# EAGLE design xbee-radio (EAGLE 6.3)
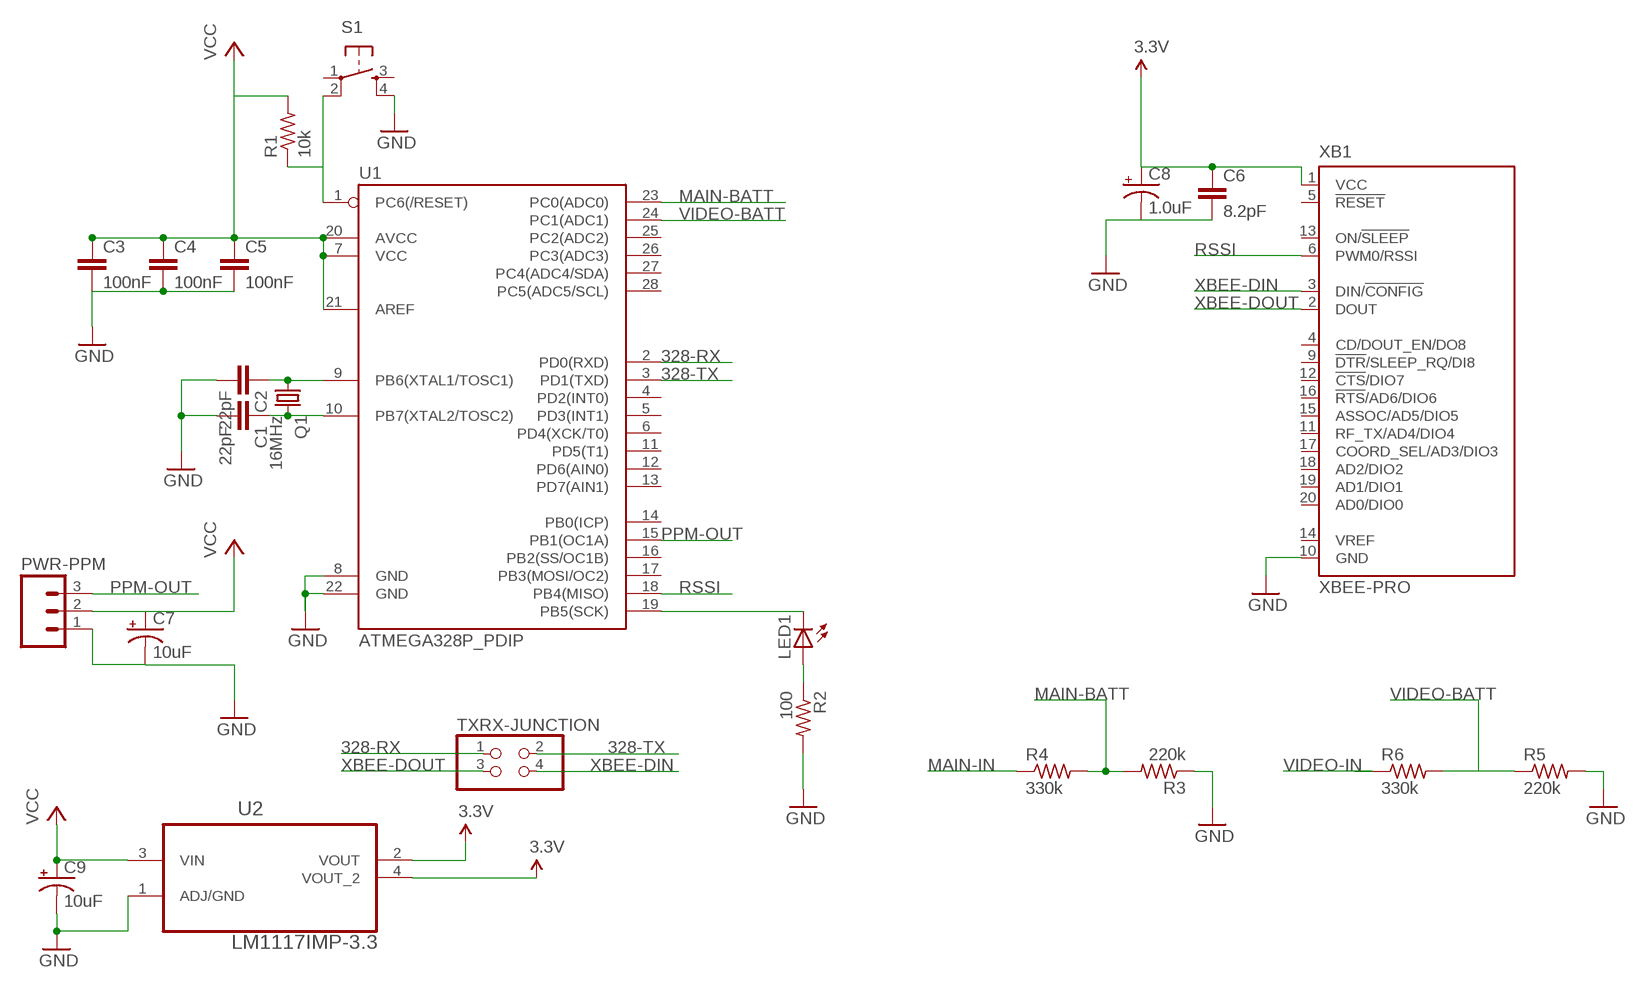
[diagram p0: schematic, sheet 1]

## Parts
C1  22pF  C2.5/2  [C2.5-2]
C2  22pF  C2.5/2  [C2.5-2]
C3  100nF  C2.5/2  [C2.5-2]
C4  100nF  C2.5/2  [C2.5-2]
C5  100nF  C2.5/2  [C2.5-2]
C6  8.2pF  C2.5/2  [C2.5-2]
C7  10uF  CPOL-USE2-5  [E2-5]
C8  1.0uF  CPOL-USE2-5  [E2-5]
C9  10uF  CPOL-USE2-5  [E2-5]
LED1  LED3MM  [LED3MM]
PWR-PPM  M03PTH  [1X03]
Q1  16MHz  CRYSTALTC26V  [TC26V]
R1  10k  R-US_0204/5  [0204/5]
R2  100  R-US_0204/5  [0204/5]
R3  220k  R-US_0204/5  [0204/5]
R4  330k  R-US_0204/5  [0204/5]
R5  220k  R-US_0204/5  [0204/5]
R6  330k  R-US_0204/5  [0204/5]
S1  TAC_SWITCHPTH  [TACTILE-PTH]
TXRX-JUNCTION  PINHD-2X2  [2X02]
U1  ATMEGA328P_PDIP  [DIL28-3]
U2  LM1117IMP-3.3  [SOT230P696X180-4N]
XB1  XBEE-PRO  [XBEE-PRO]

## Nets
3.3V: C6.1 C8.+ U2.2(VOUT) U2.4(VOUT_2) XB1.1(VCC)
328-RX: TXRX-JUNCTION.1 U1.2(PD0(RXD))
328-TX: TXRX-JUNCTION.2 U1.3(PD1(TXD))
GND: C1.2 C2.2 C3.2 C4.2 C5.2 C6.2 C7.- C8.- C9.- PWR-PPM.1 R2.2 R3.1 R5.2 S1.4 U1.8(GND) U1.22(GND) U2.1(ADJ/GND) XB1.10(GND)
MAIN-BATT: R3.2 R4.2 U1.23(PC0(ADC0))
MAIN-IN: R4.1
N$1: R1.1 S1.2 U1.1(PC6(/RESET))
N$2: C1.1 Q1.2 U1.10(PB7(XTAL2/TOSC2))
N$3: C2.1 Q1.1 U1.9(PB6(XTAL1/TOSC1))
N$4: LED1.K(C) U1.19(PB5(SCK))
N$5: LED1.A R2.1
PPM-OUT: PWR-PPM.3 U1.15(PB1(OC1A))
RSSI: U1.18(PB4(MISO)) XB1.6(PWM0/RSSI)
VCC: C3.1 C4.1 C5.1 C7.+ C9.+ PWR-PPM.2 R1.2 U1.7(VCC) U1.20(AVCC) U1.21(AREF) U2.3(VIN)
VIDEO-BATT: R5.1 R6.2 U1.24(PC1(ADC1))
VIDEO-IN: R6.1
XBEE-DIN: TXRX-JUNCTION.4 XB1.3(DIN/!CONFIG)
XBEE-DOUT: TXRX-JUNCTION.3 XB1.2(DOUT)
Unconnected: S1.1 S1.3 U1.4(PD2(INT0)) U1.5(PD3(INT1)) U1.6(PD4(XCK/T0)) U1.11(PD5(T1)) U1.12(PD6(AIN0)) U1.13(PD7(AIN1)) U1.14(PB0(ICP)) U1.16(PB2(SS/OC1B)) U1.17(PB3(MOSI/OC2)) U1.25(PC2(ADC2)) U1.26(PC3(ADC3)) U1.27(PC4(ADC4/SDA)) U1.28(PC5(ADC5/SCL)) XB1.4(CD/DOUT_EN/DO8) XB1.5(!RESET) XB1.9(!DTR!/SLEEP_RQ/DI8) XB1.11(RF_TX/AD4/DIO4) XB1.12(!CTS!/DIO7) XB1.13(ON/!SLEEP) XB1.14(VREF) XB1.15(ASSOC/AD5/DIO5) XB1.16(!RTS!/AD6/DIO6) XB1.17(COORD_SEL/AD3/DIO3) XB1.18(AD2/DIO2) XB1.19(AD1/DIO1) XB1.20(AD0/DIO0)

## Library data of the parts
C1-C6 = capacitor-wima:C: CAPACITOR naming: grid - package width
C7-C9 = resistor:CPOL-US: POLARIZED CAPACITOR, American symbol
LED1 = led:LED: LED OSRAM: - CHIPLED LG R971, LG N971, LY N971, LG Q971, LY Q971, LO R971, LY R971 LH N974, LH R974 LS Q976, LO Q976, LY Q976 LO Q996 - Hyper CHIPLED LW Q18S LB Q993, LB Q99A, LB R99A - SideLED LS A670, LO A670, LY A670, LG A670, LP A670 LB A673, LV A673, LT A673, LW A673 LH A674 LY A675 LS A676, LA A676, LO A676, LY A676, LW A676 LS A679, LY A679, LG A679 - Hyper Micro SIDELED® LS Y876, LA Y876, LO Y876, LY Y876 LT Y87S - SmartLED LW L88C, LW L88S LB L89C, LB L89S, LG L890 LS L89K, LO L89K, LY L89K LS L896, LA L896, LO L896, LY L896 - TOPLED LS T670, LO T670, LY T670, LG T670, LP T670 LSG T670, LSP T670, LSY T670, LOP T670, LYG T670 LG T671, LOG T671, LSG T671 LB T673, LV T673, LT T673, LW T673 LH T674 LS T676, LA T676, LO T676, LY T676, LB T676, LH T676, LSB T676, LW T676 LB T67C, LV T67C, LT T67C, LS T67K, LO T67K, LY T67K, LW E67C LS E67B, LA E67B, LO E67B, LY E67B, LB E67C, LV E67C, LT E67C LW T67C LS T679, LY T679, LG T679 LS T770, LO T770, LY T770, LG T770, LP T770 LB T773, LV T773, LT T773, LW T773 LH T774 LS E675, LA E675, LY E675, LS T675 LS T776, LA T776, LO T776, LY T776, LB T776 LHGB T686 LT T68C, LB T68C - Hyper Mini TOPLED® LB M676 - Mini TOPLED Santana® LG M470 LS M47K, LO M47K, LY M47K Source: http://www.osram.convergy.de LUXEON: - LUMILED® LXK2-PW12-R00, LXK2-PW12-S00, LXK2-PW14-U00, LXK2-PW14-V00 LXK2-PM12-R00, LXK2-PM12-S00, LXK2-PM14-U00 LXK2-PE12-Q00, LXK2-PE12-R00, LXK2-PE12-S00, LXK2-PE14-T00, LXK2-PE14-U00 LXK2-PB12-K00, LXK2-PB12-L00, LXK2-PB12-M00, LXK2-PB14-N00, LXK2-PB14-P00, LXK2-PB14-Q00 LXK2-PR12-L00, LXK2-PR12-M00, LXK2-PR14-Q00, LXK2-PR14-R00 LXK2-PD12-Q00, LXK2-PD12-R00, LXK2-PD12-S00 LXK2-PH12-R00, LXK2-PH12-S00 LXK2-PL12-P00, LXK2-PL12-Q00, LXK2-PL12-R00 Source: www.luxeon.com KINGBRIGHT: KA-3528ASYC Source: www.kingbright.com
PWR-PPM = SparkFun-Connectors:M03: Header 3 Standard 3-pin 0.1" header. Use with straight break away headers (SKU : PRT-00116), right angle break away headers (PRT-00553), swiss pins (PRT-00743), machine pins (PRT-00117), and female headers (PRT-00115). Molex polarized connector foot print use with SKU : PRT-08232 with associated crimp pins and housings.
Q1 = crystal:CRYSTAL: CRYSTAL; OC_FARNELL: unknown; OC_NEWARK: unknown
R1-R6 = rcl:R-US_: RESISTOR, American symbol
S1 = SparkFun-Electromechanical:TAC_SWITCH: Momentary Switch Button commonly used for reset or general input. Spark Fun Electronics SKU : COM-00097 SMT- SWCH-08247
TXRX-JUNCTION = pinhead:PINHD-2X2: PIN HEADER
U1 = SparkFun-DigitalIC:ATMEGA328P_PDIP: uC used in the Arduino 32kb flash, 1k EEPROM, 2k SRAM This is the through-hole version of this chip.
U2 = NSC_By_element14_Batch_1:LM1117IMP-3.3: IC REG LDO 800MA 3.3V; MPN: LM1117IMP-3.3; OC_FARNELL: 1469051; OC_NEWARK: 41K3450; PACKAGE: SOT-223; SUPPLIER: National Semiconductor
XB1 = maxstream:XBEE: XBee (TM) /XBee-PRO(TM) OEM RF Modules Source: MaxStream, Inc. xbee_productmanual.pdf; MPN: XBP24-AWI-001; OC_FARNELL: 1337916; OC_NEWARK: 42M2667

## Board
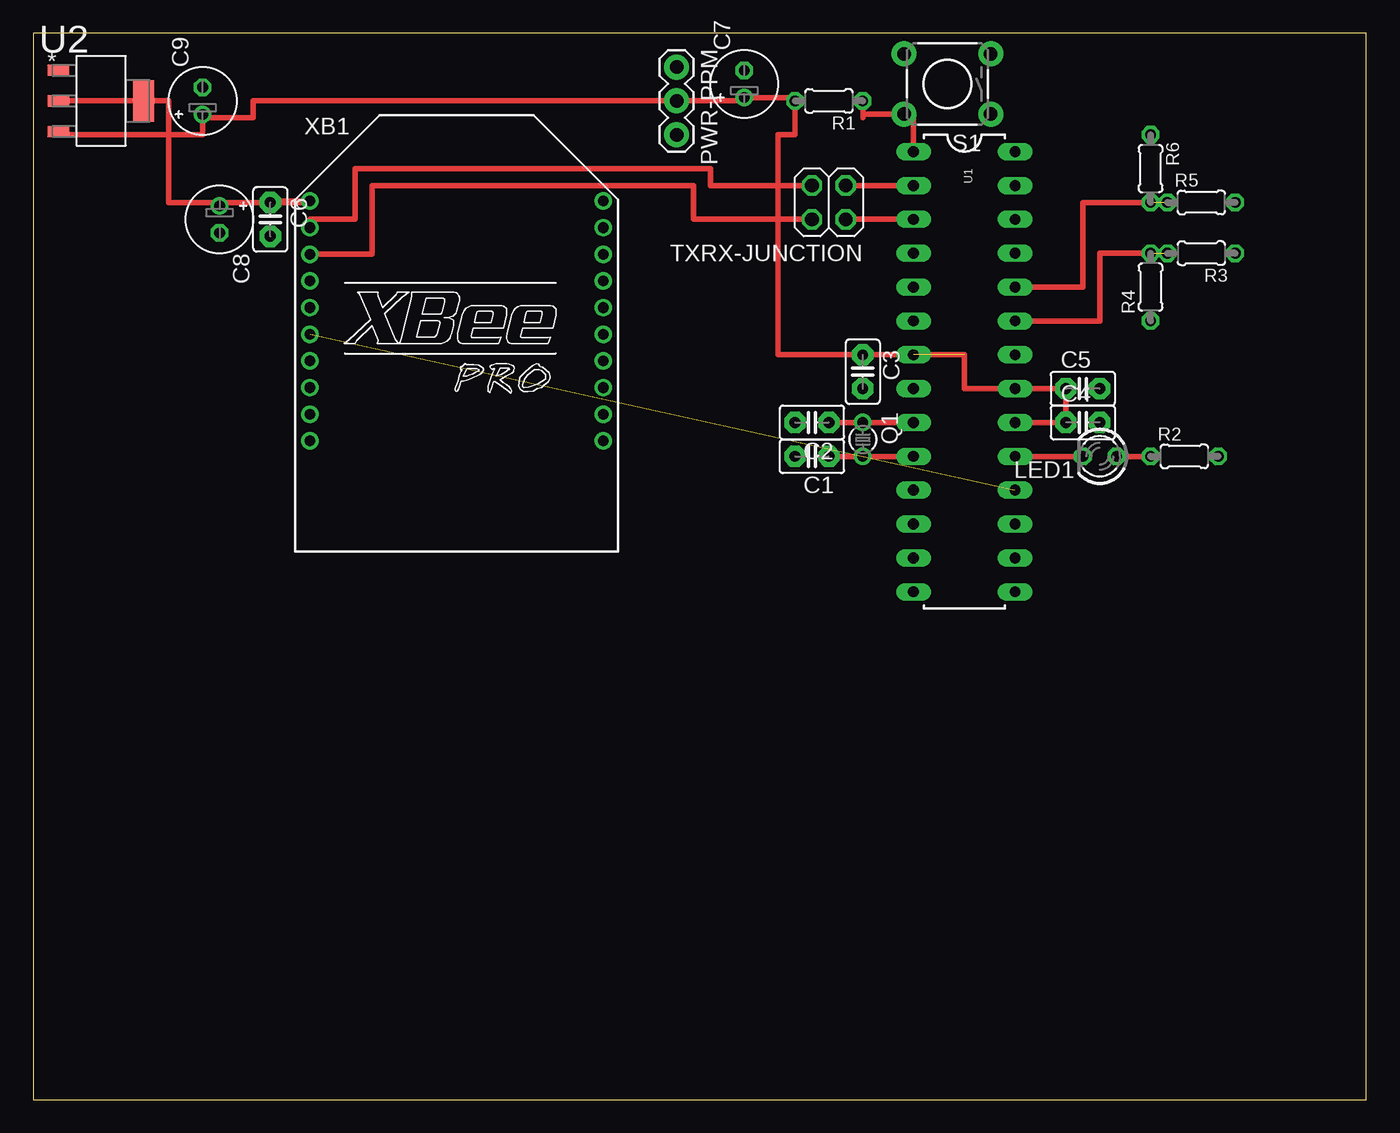
[diagram p1: board, top side]
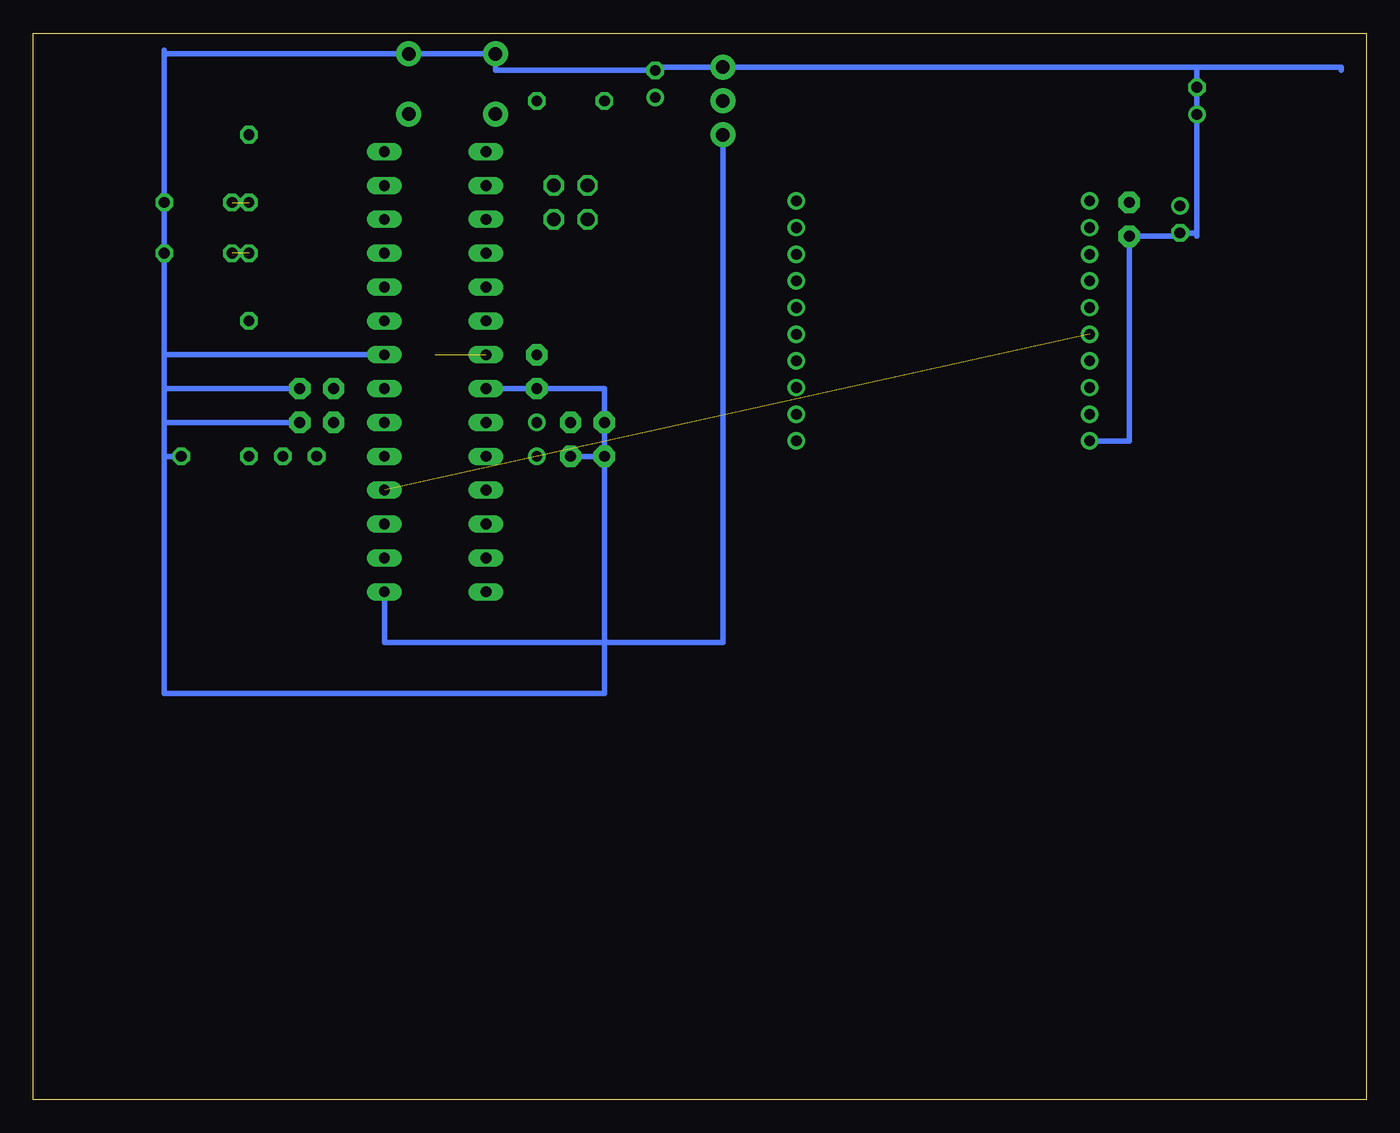
[diagram p2: board, bottom side, seen from below]

Size 100 x 80 mm. Coordinates in mm from the lower left corner, seen from the top.
Outline: 0,0 100,0 100,80 0,80 0,0
Copper layers (1*16): Top 0.035mm / dielectric 1.5mm / Bottom 0.035mm
Design rules "default": minimum track width 10mil, minimum drill 24mil, track to track 8mil, track to pad 8mil, pad to pad 8mil, via to via 8mil, smd to smd 8mil, copper to edge 40mil, drill to drill 8mil, minimum pad ring 10mil, minimum via ring 8mil, stop-mask expansion 4mil, vias tented up to drill 0mil, thermal gap 10mil

### Footprints (pad centres in the part's own frame; a part is rotated, then mirrored left to right if it is on the bottom)
C2.5-2 = drill 0.813 pad 1.6 octagon: 1 -1.27,0; 2 1.27,0
E2-5 = drill 0.813 pad 1.27: + -1.016,0 | drill 0.813 pad 1.27 octagon: - 1.016,0
LED3MM = drill 0.813 octagon: A -1.27,0; K 1.27,0
1X03 = drill 1.016 pad 1.88: 1 0,0; 2 2.54,0; 3 5.08,0
TC26V = drill 0.813: 1 -1.27,0; 2 1.27,0
0204/5 = drill 0.813 octagon: 1 -2.54,0; 2 2.54,0
TACTILE-PTH = drill 1.016 pad 1.88: 1 -3.251,2.261; 2 3.251,2.261; 3 -3.251,-2.261; 4 3.251,-2.261
2X02 = drill 1.016 octagon: 1 -1.27,-1.27; 2 -1.27,1.27; 3 1.27,-1.27; 4 1.27,1.27
DIL28-3 = drill 0.813 long: 1 -16.51,-3.81; 2 -13.97,-3.81; 3 -11.43,-3.81; 4 -8.89,-3.81; 5 -6.35,-3.81; 6 -3.81,-3.81; 7 -1.27,-3.81; 8 1.27,-3.81; 9 3.81,-3.81; 10 6.35,-3.81; 11 8.89,-3.81; 12 11.43,-3.81; 13 13.97,-3.81; 14 16.51,-3.81; 15 16.51,3.81; 16 13.97,3.81; 17 11.43,3.81; 18 8.89,3.81; 19 6.35,3.81; 20 3.81,3.81; 21 1.27,3.81; 22 -1.27,3.81; 23 -3.81,3.81; 24 -6.35,3.81; 25 -8.89,3.81; 26 -11.43,3.81; 27 -13.97,3.81; 28 -16.51,3.81
SOT230P696X180-4N = smd 1.6 x 0.838: 1 -3.2,2.311; 2 -3.2,0; 3 -3.2,-2.311 | smd 1.6 x 3.099: 4 3.2,0
XBEE-PRO = drill 0.8 pad 1.27: 1 -11,9; 2 -11,7; 3 -11,5; 4 -11,3; 5 -11,1; 6 -11,-1; 7 -11,-3; 8 -11,-5; 9 -11,-7; 10 -11,-9; 11 11,-9; 12 11,-7; 13 11,-5; 14 11,-3; 15 11,-1; 16 11,1; 17 11,3; 18 11,5; 19 11,7; 20 11,9

### Placement (x,y rotation side)
C1  58.42,48.26 180 top
C2  58.42,50.8 180 top
C3  62.23,54.61 270 top
C4  78.74,50.8 0 top
C5  78.74,53.34 0 top
C6  17.78,66.04 270 top
C7  53.34,76.2 90 top
C8  13.97,66.04 270 top
C9  12.7,74.93 90 top
LED1  80.01,48.26 180 top
PWR-PPM  48.26,77.47 270 top
Q1  62.23,49.53 270 top
R1  59.69,74.93 180 top
R2  86.36,48.26 0 top
R3  87.63,63.5 180 top
R4  83.82,60.96 90 top
R5  87.63,67.31 0 top
R6  83.82,69.85 270 top
S1  68.58,76.2 180 top
TXRX-JUNCTION  59.69,67.31 180 top
U1  69.85,54.61 270 top
U2  5.08,74.93 0 top
XB1  31.75,58.42 0 top

### Tracks (layer width: path | path; a pad name or v marks a point on that pad's centre or on a via)
3.3V
  Top 0.406: U2.2 U2.4 10.16,74.93 10.16,67.31 C6.1 | C6.1 20.75,67.31 XB1.1 17.78,67.42 C6.1 | C6.1 13.97,67.31 C8.+
328-RX
  Top 0.406: U1.2 TXRX-JUNCTION.1
328-TX
  Top 0.406: U1.3 TXRX-JUNCTION.2
GND  (1 unrouted)
  Bottom 0.406: 12.7,77.47 C9.- 12.7,65.02 | 12.7,77.47 1.88,77.47 U2.1 | 12.7,77.47 PWR-PPM.1 53.34,77.47 C7.- 65.33,77.22 S1.4 90.17,78.46 | XB1.10 17.78,49.42 C6.2 13.97,64.77 C8.- 12.7,65.02 | 12.7,65.02 12.7,64.77 | 90.17,78.46 90.17,78.74 | 90.17,78.46 R5.2 R3.1 | R3.1 90.17,55.88 | 90.17,55.88 90.17,53.34 | 90.17,53.34 90.17,50.8 | 90.17,50.8 90.17,48.26 R2.2 | C5.2 90.17,53.34 | U1.22 90.17,55.88 | C4.2 90.17,50.8 | U1.8 C3.2 57.15,53.34 C2.2 C1.2 57.15,30.48 90.17,30.48 R3.1
MAIN-BATT  (1 unrouted)
  Top 0.406: U1.23 80.01,58.42 80.01,63.5 R4.2
N$1
  Top 0.406: U1.1 66.04,73.66 65.33,73.66 S1.2 62.23,73.94 | 62.23,73.94 62.23,73.66 | 62.23,73.94 R1.1
N$2
  Top 0.406: U1.10 Q1.2 C1.1
  Bottom 0.406: C1.1 57.15,48.26 57.15,30.48 90.17,30.48 90.17,48.26 88.9,48.26
N$3
  Top 0.406: U1.9 Q1.1 C2.1
N$4
  Top 0.406: LED1.K U1.19
N$5
  Top 0.406: LED1.A R2.1
PPM-OUT
  Bottom 0.406: U1.15 73.66,34.29 48.26,34.29 PWR-PPM.3
RSSI  (1 unrouted)
VCC  (1 unrouted)
  Top 0.406: 12.7,73.66 16.51,73.66 16.51,74.93 PWR-PPM.2 53.34,74.93 C7.+ 57.15,75.18 R1.2 57.15,72.39 55.88,72.39 55.88,55.88 C3.1 69.85,55.88 69.85,53.34 U1.21 C5.1 C4.1 U1.20 | 12.7,73.66 C9.+ | 12.7,73.66 12.7,72.39 1.88,72.39 U2.3
VIDEO-BATT  (1 unrouted)
  Top 0.406: R6.2 78.74,67.31 78.74,60.96 U1.24
XBEE-DIN
  Top 0.406: XB1.3 25.4,63.42 25.4,68.58 49.53,68.58 49.53,66.04 TXRX-JUNCTION.4
XBEE-DOUT
  Top 0.406: TXRX-JUNCTION.3 50.8,68.58 50.8,69.85 24.13,69.85 24.13,66.04 20.75,66.04 XB1.2